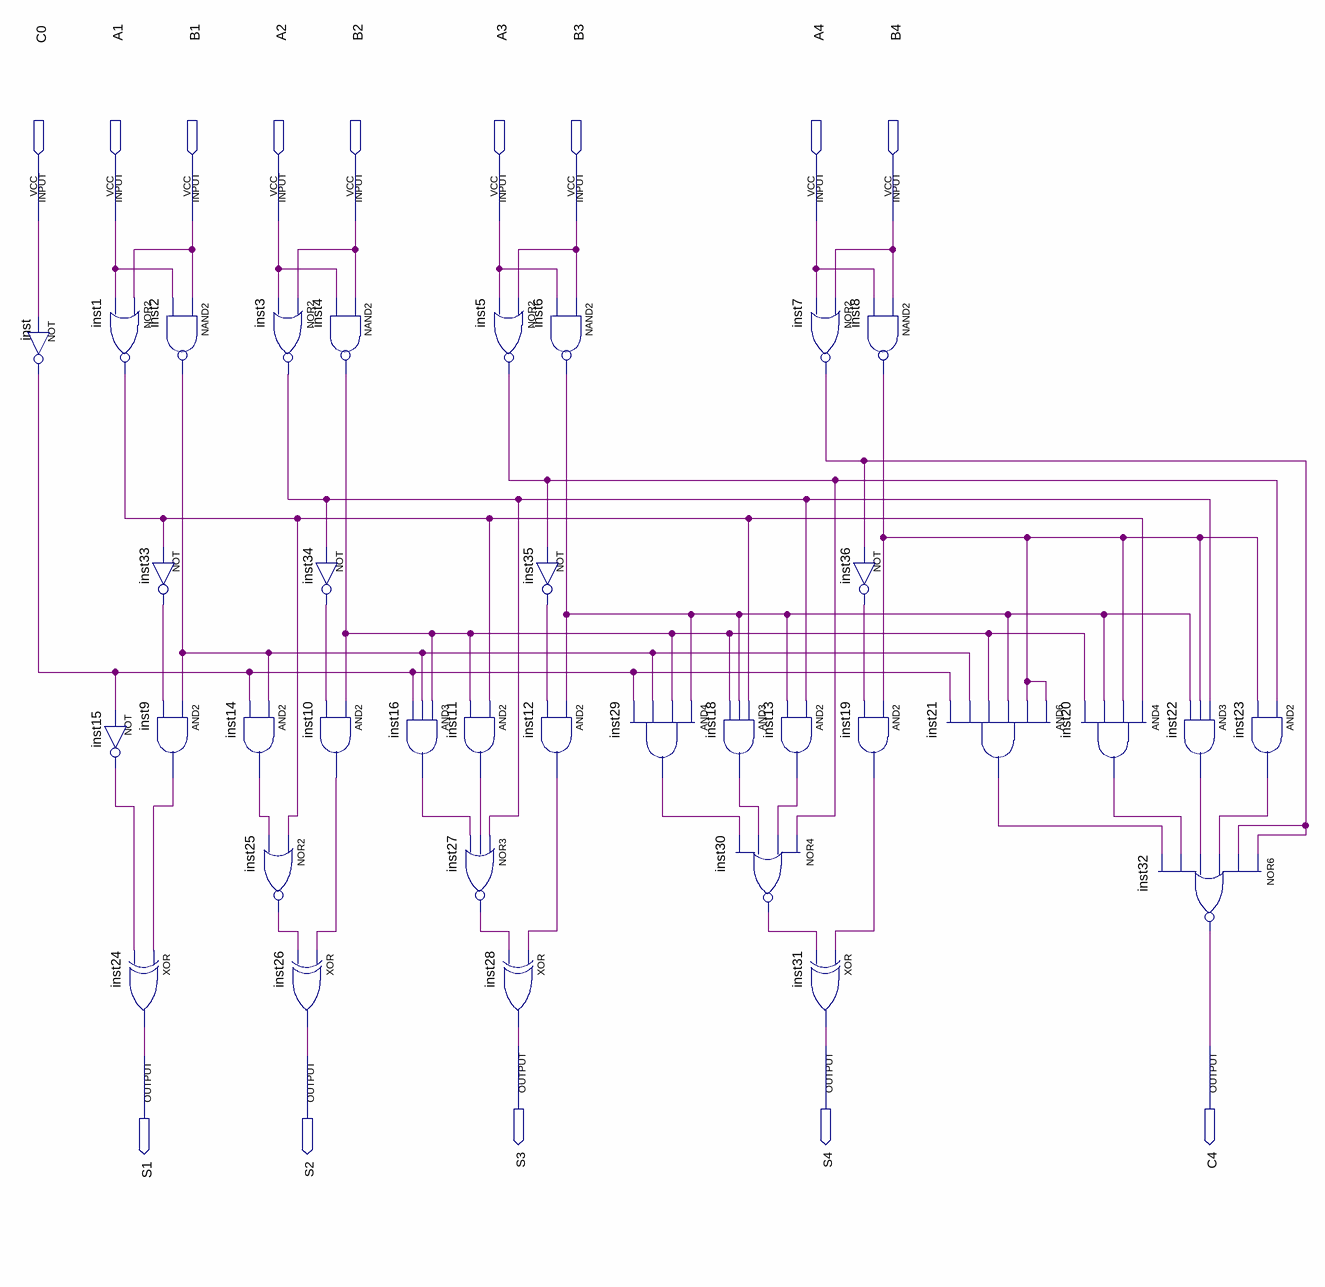
[diagram p0: schematic sheet]
// Quartus schematic SomadorCompleto4bits.bdf as structural Verilog: 36 symbols, 14 pins
module SomadorCompleto4bits (
  input  C0,
  input  A1,
  input  B1,
  input  A2,
  input  B2,
  input  A3,
  input  B3,
  input  A4,
  input  B4,
  output S3,
  output S4,
  output C4,
  output S1,
  output S2
);

  wire inst1_out, inst2_out, inst3_out, inst4_out, inst5_out, inst6_out, inst7_out, inst8_out, inst9_out,
       inst10_out, inst11_out, inst12_out, inst13_out, inst14_out, inst15_out, inst16_out, inst18_out,
       inst19_out, inst20_out, inst21_out, inst22_out, inst23_out, inst25_out, inst27_out, inst29_out,
       inst30_out, inst33_out, inst34_out, inst35_out, inst36_out, inst_out;

  not inst (inst_out, C0);
  nor inst1 (inst1_out, B1, A1);
  not inst15 (inst15_out, inst_out);
  xor inst24 (S1, inst9_out, inst15_out);
  nand inst2 (inst2_out, B1, A1);
  not inst33 (inst33_out, inst1_out);
  and inst9 (inst9_out, inst2_out, inst33_out);
  nor inst3 (inst3_out, B2, A2);
  and inst14 (inst14_out, inst2_out, inst_out);
  nor inst25 (inst25_out, inst1_out, inst14_out);
  nand inst4 (inst4_out, B2, A2);
  not inst34 (inst34_out, inst3_out);
  and inst10 (inst10_out, inst4_out, inst34_out);
  xor inst26 (S2, inst10_out, inst25_out);
  and inst16 (inst16_out, inst4_out, inst2_out, inst_out);
  nor inst5 (inst5_out, B3, A3);
  and inst11 (inst11_out, inst1_out, inst4_out);
  nor inst27 (inst27_out, inst3_out, inst11_out, inst16_out);
  xor inst28 (S3, inst12_out, inst27_out);
  nand inst6 (inst6_out, B3, A3);
  not inst35 (inst35_out, inst5_out);
  and inst12 (inst12_out, inst6_out, inst35_out);
  and inst29 (inst29_out, inst6_out, inst4_out, inst2_out, inst_out);
  and inst18 (inst18_out, inst1_out, inst6_out, inst4_out);
  nor inst30 (inst30_out, inst5_out, inst13_out, inst18_out, inst29_out);
  nor inst7 (inst7_out, B4, A4);
  and inst13 (inst13_out, inst3_out, inst6_out);
  xor inst31 (S4, inst19_out, inst30_out);
  nand inst8 (inst8_out, B4, A4);
  not inst36 (inst36_out, inst7_out);
  and inst19 (inst19_out, inst8_out, inst36_out);
  and inst21 (inst21_out, inst8_out, inst8_out, inst6_out, inst4_out, inst2_out, inst_out);
  and inst20 (inst20_out, inst1_out, inst8_out, inst6_out, inst4_out);
  and inst22 (inst22_out, inst3_out, inst8_out, inst6_out);
  nor inst32 (C4, inst7_out, inst7_out, inst23_out, inst22_out, inst20_out, inst21_out);
  and inst23 (inst23_out, inst5_out, inst8_out);
endmodule
